# Altium project mkl16_DevBoard.PrjPcb
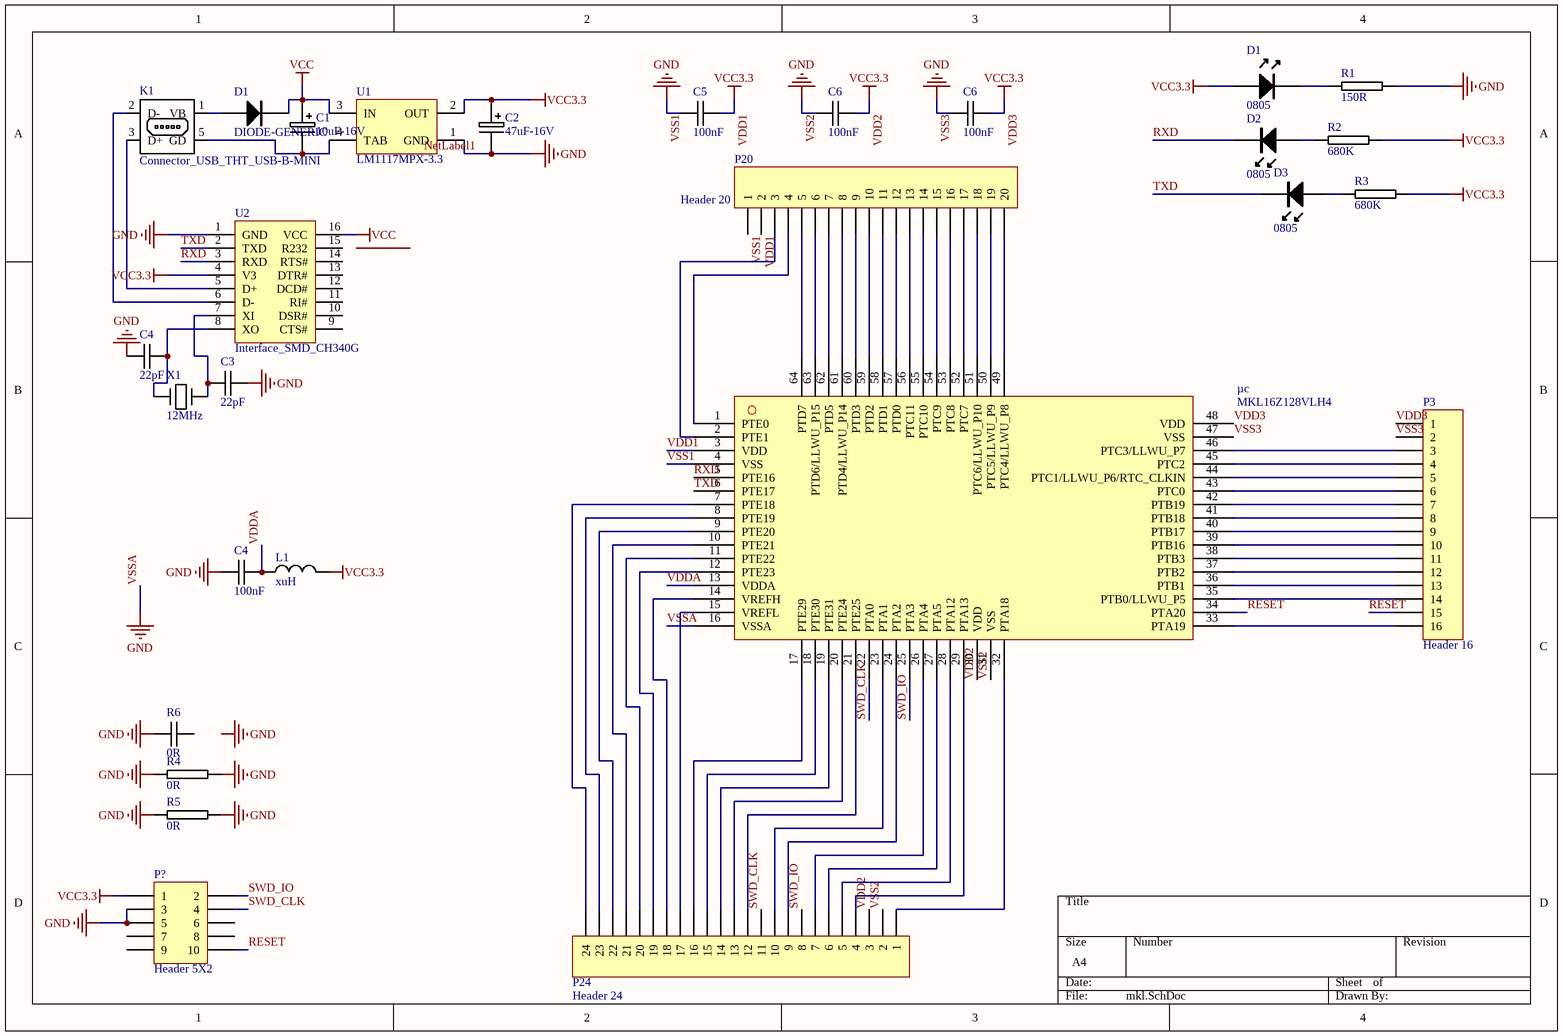
[diagram p0: mkl.SchDoc]
1 sheet, 28 parts. Net scope: global (net labels, ports and power ports of the same name join across sheets).
Board file: mkl.PcbDoc

## Sheet mkl.SchDoc
size A4

### Parts
(Parts that share a designator on the sheet are numbered #1, #2 ... from top to bottom, then left to right.)
C1  10uF-16V  [PANACAP-b]
C2  47uF-16V  [PANACAP-D-GENERIC]
C3  22pF  [0603C-GENERIC]
C4#1  22pF  [0603C-GENERIC]
C4#2  100nF  [0603C-GENERIC]
C5  100nF  [0603C-GENERIC]
C6#1  100nF  [0603C-GENERIC]
C6#2  100nF  [0603C-GENERIC]
D1#1  0805  [0805LED]
D1#2  DIODE-GENERIC  [DO-213AB(MELF)]
D2  0805  [0805LED]
D3  0805  [0805LED]
K1  Connector_USB_THT_USB-B-MINI  [USB-MINI-B]
L1  xuH  [L0402]
P3  Header 16  [HDR1X16]
P20  Header 20  [HDR1X20]
P24  Header 24  [HDR1X24]
P?  Header 5X2  [HDR2X5]
R1  150R  [0402R-GENERIC]
R2  680K  [0603R-680K]
R3  680K  [0603R-680K]
R4  0R  [0603R-0R]
R5  0R  [0603R-0R]
R6  0R  [1210C-GENERIC]
U1  LM1117MPX-3.3  [MP04A_N]
U2  Interface_SMD_CH340G  [SO16]
X1  12MHz  [XTAL-HC49US-7MM]
µc  MKL16Z128VLH4  [LQFP64_L]

### Nets
VCC: C1.+ D1#2.K U1.3(IN) U2.16(VCC)
VDD1: C2.+ C5.2 C6#1.2 C6#2.2 D1#1.A L1.2 P3.1 P20.2 P24.3 P?.1 R2.2 R3.2 U1.2(OUT) U2.4(V3) µc.3(VDD) µc.30(VDD) µc.48(VDD)  [also labelled VCC3.3, VDD2, VDD3]
VSS1: C2.- C3.2 C4#1.1 C4#2.1 C5.1 C6#1.1 C6#2.1 P3.2 P20.1 P24.2 P?.3 P?.5 R1.2 R4.1 R4.2 R5.1 R5.2 R6.1 U1.1(GND) U2.1(GND) µc.4(VSS) µc.16(VSSA) µc.31(VSS) µc.47(VSS)  [also labelled GND, VSS2, VSS3, VSSA]
RESET: P3.15 P?.10 µc.34(PTA20)
RXD: D2.K U2.3(RXD) µc.5(PTE16)
SWD_CLK: P24.11 P?.4 µc.22(PTA0)
SWD_IO: P24.8 P?.2 µc.25(PTA3)
TXD: D3.K U2.2(TXD) µc.6(PTE17)
VDDA: C4#2.2 L1.1 µc.13(VDDA)
NetC1_-: C1.- K1.5(GD) U1.4(TAB)
NetC3_1: C3.1 U2.7(XI) X1.2
NetC4#1_2: C4#1.2 U2.8(XO) X1.1
NetD1#1_K: D1#1.K R1.1
NetD1#2_A: D1#2.A K1.1(VB)
NetD2_A: D2.A R2.1
NetD3_A: D3.A R3.1
NetK1_2: K1.2(D-) U2.6(D-)
NetK1_3: K1.3(D+) U2.5(D+)
NetP3_3: P3.3 µc.46(PTC3/LLWU_P7)
NetP3_4: P3.4 µc.45(PTC2)
NetP3_5: P3.5 µc.44(PTC1/LLWU_P6/RTC_CLKIN)
NetP3_6: P3.6 µc.43(PTC0)
NetP3_7: P3.7 µc.42(PTB19)
NetP3_8: P3.8 µc.41(PTB18)
NetP3_9: P3.9 µc.40(PTB17)
NetP3_10: P3.10 µc.39(PTB16)
NetP3_11: P3.11 µc.38(PTB3)
NetP3_12: P3.12 µc.37(PTB2)
NetP3_13: P3.13 µc.36(PTB1)
NetP3_14: P3.14 µc.35(PTB0/LLWU_P5)
NetP3_16: P3.16 µc.33(PTA19)
NetP20_3: P20.3 µc.2(PTE1)
NetP20_4: P20.4 µc.1(PTE0)
NetP20_5: P20.5 µc.64(PTD7)
NetP20_6: P20.6 µc.63(PTD6/LLWU_P15)
NetP20_7: P20.7 µc.62(PTD5)
NetP20_8: P20.8 µc.61(PTD4/LLWU_P14)
NetP20_9: P20.9 µc.60(PTD3)
NetP20_10: P20.10 µc.59(PTD2)
NetP20_11: P20.11 µc.58(PTD1)
NetP20_12: P20.12 µc.57(PTD0)
NetP20_13: P20.13 µc.56(PTC11)
NetP20_14: P20.14 µc.55(PTC10)
NetP20_15: P20.15 µc.54(PTC9)
NetP20_16: P20.16 µc.53(PTC8)
NetP20_17: P20.17 µc.52(PTC7)
NetP20_18: P20.18 µc.51(PTC6/LLWU_P10)
NetP20_19: P20.19 µc.50(PTC5/LLWU_P9)
NetP20_20: P20.20 µc.49(PTC4/LLWU_P8)
NetP24_1: P24.1 µc.32(PTA18)
NetP24_4: P24.4 µc.29(PTA13)
NetP24_5: P24.5 µc.28(PTA12)
NetP24_6: P24.6 µc.27(PTA5)
NetP24_7: P24.7 µc.26(PTA4)
NetP24_9: P24.9 µc.24(PTA2)
NetP24_10: P24.10 µc.23(PTA1)
NetP24_12: P24.12 µc.21(PTE25)
NetP24_13: P24.13 µc.20(PTE24)
NetP24_14: P24.14 µc.19(PTE31)
NetP24_15: P24.15 µc.18(PTE30)
NetP24_16: P24.16 µc.17(PTE29)
NetP24_17: P24.17 µc.15(VREFL)
NetP24_18: P24.18 µc.14(VREFH)
NetP24_19: P24.19 µc.12(PTE23)
NetP24_20: P24.20 µc.11(PTE22)
NetP24_21: P24.21 µc.10(PTE21)
NetP24_22: P24.22 µc.9(PTE20)
NetP24_23: P24.23 µc.8(PTE19)
NetP24_24: P24.24 µc.7(PTE18)

Not connected (* = marked no-connect by the designer): P? 6 7 8 9; R6 2; U2 9(CTS#) 10(DSR#) 11(RI#) 12(DCD#) 13(DTR#) 14(RTS#) 15(R232)

### Notes on the sheet
- Labels drawn without touching a wire or pin: GND, NetLabel1

### Library data of the parts
C1 = Passives_Capacitors_Elco_SMD_PANACAP-10UF-16V-FK: GENERIC CAPACITOR POLARISED; Supplier 1: Digi-Key; Supplier Part Number 1: PCE3782TR-ND
C2 = Passives_Capacitors_Elco_SMD_PANACAP-47UF-16V-FK: GENERIC CAPACITOR POLARISED; Supplier 1: Digi-Key; Supplier Part Number 1: PCE3398TR-ND
C3 C4#1 = Passives_Capacitors_0603_22PF-50V-C0G-PAN: CAPACITOR 0603 CERAMIC; Manufacturer Part Number: ECJ-1VC1H220J; Manufacturer: Panasonic - ECG; Reel: C10; Tolerance: ±5%; Temperature Coefficient: C0G, NP0; Voltage - Rated: 50V; Supplier 1: Digi-Key; Features: General Purpose; Lead Spacing: -; Supplier: Digi-Key; Capacitance: 22pF; Packaging: Tape & Reel (TR); Mounting Type: Surface Mount, MLCC; RoHS: RoHS Compliant; Operating Temperature: -55°C ~ 125°C; Thickness: 0.80mm; Package / Case: 0603 (1608 metric); Category: Capacitors; Supplier Part Number 1: PCC220ACVTR-ND; Supplier Part Number: PCC220ACVTR-ND
C4#2 C5 C6#1 C6#2 = Passives_Capacitors_0603_100NF-25V-X7R-TDK: CAPACITOR 0603 CERAMIC; Manufacturer Part Number: C1608X7R1E104K; Manufacturer: TDK Corporation; Reel: C12; Supplier 1: Digi-Key; Supplier Part Number 1: 445-1316-2-ND
D1#1 D2 D3 = LED_SMD_0805
D1#2 = DIODE-GENERIC: GENERIC DIODE
K1 = Connector_USB_THT_USB-B-MINI: MINI USB B DEVICE CONNECTOR
L1 = Passives_Inductors_0402_TBD
P3 = Header 16: Header, 16-Pin; LatestRevisionDate: 17-Jul-2002; LatestRevisionNote: Re-released for DXP Platform.; Publisher: Altium Limited
P20 = Header 20: Header, 20-Pin; LatestRevisionDate: 17-Jul-2002; LatestRevisionNote: Re-released for DXP Platform.; Publisher: Altium Limited
P24 = Header 24: Header, 24-Pin; LatestRevisionDate: 17-Jul-2002; LatestRevisionNote: Re-released for DXP Platform.; Publisher: Altium Limited
P? = Header 5X2: Header, 5-Pin, Dual row; LatestRevisionDate: 17-Jul-2002; LatestRevisionNote: Re-released for DXP Platform.; Publisher: Altium Limited
R1 = Passives_Resistors_0402_100R: RESISTOR 0402 GENERIC
R2 R3 = Passives_Resistors_0603_680K: GENERIC RESISTOR 0603; Manufacturer Part Number: RMC 1/16 680K 1% R; Manufacturer: Stackpole Electronics Inc; Power (Watts): 0.1W, 1/10W; Tolerance: ±1%; Temperature Coefficient: ±100ppm/°C; Supplier 1: Digi-Key; Supplier Part Number 1: RMC1/16680KFR-ND; Case: 0603 (1608 metric); Resistance In Ohms: 680K; Supplier Part Number: RMC1/16680KFR-ND; Composition: Thick Film; Lead Style: Surface Mount (SMD - SMT); Packaging: Tape & Reel (TR); Category: Resistors; Supplier: Digi-Key; RoHS: RoHS Compliant
R4 R5 = Passives_Resistors_0603_0R: GENERIC JUMPER 0603; Manufacturer: Stackpole Electronics Inc; Manufacturer Part Number: RMC 1/16 0 G; Reel: R26; Supplier 1: Digi-Key; Supplier Part Number 1: RMCF0603ZT0R00TR-ND
R6 = Passives_Capacitors_1210_1210C-TBD: CAPACITOR 1210 CERAMIC VALUE TO BE DETERMINED
U1 = LM1117MPX-3.3: 800mA Low-Dropout Linear Regulator, 4-pin SOT-223; Manufacturer: National Semiconductor; PackageTopMarking: XYTT*N05A; PowerWise: N; CompType: LDO IC; Published: 1-Mar-2010; DatasheetVersion: Apr-2006; PackageVersion: revB, Apr-2003; PackageReference: MP04A; Publisher: Altium Limited; PackageDescription: Molded SOT-223, 6.50 x 3.56 x 1.6mm Body, 4 Lead, 2.3mm Pitch; Supplier 1: Farnell; Supplier Part Number 1: 1652313; PartNumber: LM1117MPX-3.3; RoHS: N; PinCount: 4; Code_JEDEC: TO-261-AA; Code_IPC: SOT223-4; ComponentLink1Description: LM1117 Datasheet; ComponentLink1URL: http://www.national.com/ds/LM/LM1117.pdf; ComponentLink2Description: LM1117 Web Page; ComponentLink2URL: http://www.national.com/pf/LM/LM1117.html; ComponentLink3Description: MP04A Package Page; ComponentLink3URL: http://www.national.com/packaging/folders/mp04a.html
X1 = 12MC-HC49US-7MM: 12MHz CRYSTAL HC49US SHORT BODY; Supplier 1: Mouser; Supplier Part Number 1: 520-120-20-3XT